# Altium schematic sheet Teensy3.2.SchDoc
size A
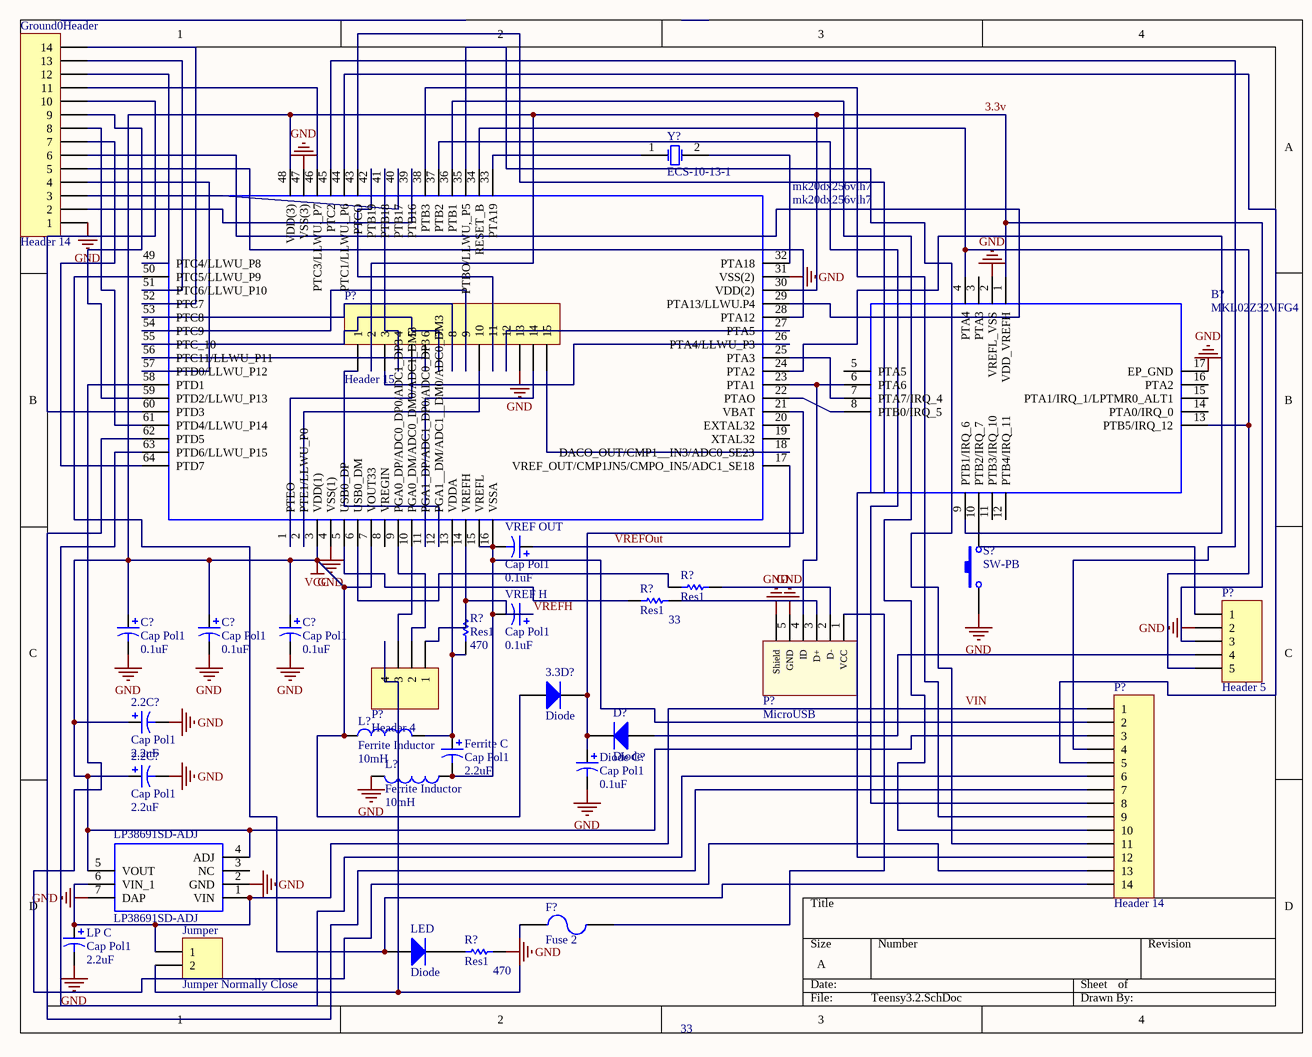
[diagram p0: Teensy3.2.SchDoc]

## Parts
(Parts that share a designator on the sheet are numbered #1, #2 ... from top to bottom, then left to right.)
2.2C?#1  Cap Pol1  value 2.2uF  [RAD-0.2]
2.2C?#2  Cap Pol1  value 2.2uF  [RAD-0.2]
3.3D?  Diode  [SMC]
B?  MKL02Z32VFG4  [QFN50P300X300X65-17N-D]
C?#1  Cap Pol1  value 0.1uF  [RAD-0.1]
C?#2  Cap Pol1  value 0.1uF  [RAD-0.1]
C?#3  Cap Pol1  value 0.1uF  [RAD-0.1]
D?  Diode  [SMC]
Diode_C?  Cap Pol1  value 0.1uF  [RAD-0.1]
F?  Fuse 2  [PIN-W2/E2.8]
Ferrite_C  Cap Pol1  value 2.2uF  [RAD-0.2]
Ground0Header  Header 14  [HDR1X14]
Jumper  Jumper Normally Close  [HDR1X2]
L?#1  Ferrite Inductor  value 10mH  [0402-A]
L?#2  Ferrite Inductor  value 10mH  [0402-A]
LED  Diode  [SMC]
LP38691SD-ADJ  LP38691SD-ADJ  [SON95P300X300X80-7N]
LP_C  Cap Pol1  value 2.2uF  [RAD-0.2]
mk20dx256vlh7  mk20dx256vlh7  [QFP50P1200X1200X160-64N]
P?#1  Header 15  [HDR1X15]
P?#2  Header 5  [HDR1X5]
P?#3  MicroUSB  [629105136821]
P?#4  Header 4  [HDR1X4]
P?#5  Header 14  [HDR1X14]
R?#1  Res1  value 33  [AXIAL-0.3]
R?#2  Res1  value 33  [AXIAL-0.3]
R?#3  Res1  value 470  [AXIAL-0.3]
R?#4  Res1  value 470  [AXIAL-0.3]
S?  SW-PB  [SPST-2]
VREF_H  Cap Pol1  value 0.1uF  [RAD-0.1]
VREF_OUT  Cap Pol1  value 0.1uF  [RAD-0.1]
Y?  ECS-10-13-1  [HC-49U]

## Nets
3.3v: 2.2C?#1.1 2.2C?#2.1 3.3D?.1(A) B?.1(VDD_VREFH) C?#1.1 C?#2.1 C?#3.1 L?#1.1 LP38691SD-ADJ.4(ADJ) LP38691SD-ADJ.5(VOUT) mk20dx256vlh7.3(VDD(1)) mk20dx256vlh7.7(VOUT33) mk20dx256vlh7.30(VDD(2)) mk20dx256vlh7.48(VDD(3)) P?#1.2 P?#2.3 P?#5.3  [also labelled VCC]
GND: 2.2C?#1.2 2.2C?#2.2 B?.2(VREFL_VSS) B?.17(EP_GND) C?#1.2 C?#2.2 C?#3.2 Diode_C?.2 Ground0Header.1 L?#2.2 LP38691SD-ADJ.2(GND) LP38691SD-ADJ.7(DAP) LP_C.2 mk20dx256vlh7.4(VSS(1)) mk20dx256vlh7.31(VSS(2)) mk20dx256vlh7.47(VSS(3)) P?#1.13 P?#2.2 P?#3.5(GND) P?#3.Shell(Shield) R?#4.1 S?.1
VIN: Jumper.1 LP38691SD-ADJ.1(VIN) LP38691SD-ADJ.6(VIN_1) LP_C.1 P?#5.1
VREFH: mk20dx256vlh7.14(VREFH) P?#4.1 R?#3.2 VREF_H.1
VREFOut: mk20dx256vlh7.17(VREF_OUT/CMP1JN5/CMPO_IN5/ADC1_SE18) VREF_OUT.1
Net3.3D?_2: 3.3D?.2(K) D?.2(K) Diode_C?.1 mk20dx256vlh7.21(VBAT)
NetB?_4: B?.4(PTA4) B?.13(PTB5/IRQ_12) mk20dx256vlh7.34(RESET_B) P?#2.5
NetB?_6: B?.6(PTA6) mk20dx256vlh7.23(PTA1) P?#3.4(ID)
NetB?_7: B?.7(PTA7/IRQ_4) mk20dx256vlh7.25(PTA3)
NetB?_8: B?.8(PTB0/IRQ_5) mk20dx256vlh7.22(PTAO)
NetB?_9: B?.9(PTB1/IRQ_6) mk20dx256vlh7.24(PTA2)
NetB?_10: B?.10(PTB2/IRQ_7) S?.2
NetD?_1: D?.1(A) P?#2.4
NetF?_1: F?.1 Jumper.2 P?#4.4
NetF?_2: F?.2 P?#3.1(VCC)
NetFerrite_C_1: Ferrite_C.1 L?#1.2 mk20dx256vlh7.13(VDDA) R?#3.1
NetFerrite_C_2: Ferrite_C.2 L?#2.1 mk20dx256vlh7.15(VREFL) mk20dx256vlh7.16(VSSA) P?#5.2 VREF_H.2 VREF_OUT.2
NetGround0Header_2: Ground0Header.2 mk20dx256vlh7.39(PTB16)
NetGround0Header_3: Ground0Header.3 mk20dx256vlh7.40(PTB17)
NetGround0Header_4: Ground0Header.4 mk20dx256vlh7.57(PTD0/LLWU_P12)
NetGround0Header_5: Ground0Header.5 mk20dx256vlh7.28(PTA12)
NetGround0Header_6: Ground0Header.6 mk20dx256vlh7.29(PTA13/LLWU.P4)
NetGround0Header_7: Ground0Header.7 mk20dx256vlh7.64(PTD7)
NetGround0Header_8: Ground0Header.8 mk20dx256vlh7.61(PTD4/LLWU_P14)
NetGround0Header_9: Ground0Header.9 mk20dx256vlh7.59(PTD2/LLWU_P13)
NetGround0Header_10: Ground0Header.10 mk20dx256vlh7.60(PTD3)
NetGround0Header_11: Ground0Header.11 mk20dx256vlh7.46(PTC3/LLWU._P7)
NetGround0Header_12: Ground0Header.12 mk20dx256vlh7.49(PTC4/LLWU_P8)
NetGround0Header_13: Ground0Header.13 mk20dx256vlh7.51(PTC6/LLWU_P10)
NetGround0Header_14: Ground0Header.14 mk20dx256vlh7.52(PTC7)
NetLED_1: LED.1(A) mk20dx256vlh7.50(PTC5/LLWU_P9) P?#5.14
NetLED_2: LED.2(K) R?#4.2
Netmk20dx256vlh7_1: mk20dx256vlh7.1(PTEO) P?#1.5
Netmk20dx256vlh7_2: mk20dx256vlh7.2(PTE1/LLWU_P0) P?#1.10
Netmk20dx256vlh7_5: mk20dx256vlh7.5(USB0_DP) R?#2.2
Netmk20dx256vlh7_6: mk20dx256vlh7.6(USB0_DM) R?#1.2
Netmk20dx256vlh7_9: mk20dx256vlh7.9(PGA0_DP/ADC0_DP0/ADC1_DP3) P?#4.2
Netmk20dx256vlh7_10: mk20dx256vlh7.10(PGA0_DM/ADC0_DM0/ADC1_DM3) P?#4.3
Netmk20dx256vlh7_11: mk20dx256vlh7.11(PGA1_DP/ADC1_DP0/ADC0_DP3) P?#1.14
Netmk20dx256vlh7_12: mk20dx256vlh7.12(PGA1__DM/ADC1__DM0/ADC0_DM3) P?#1.1
Netmk20dx256vlh7_18: mk20dx256vlh7.18(DACO_OUT/CMP1__IN3/ADC0_SE23) P?#1.15
Netmk20dx256vlh7_26: mk20dx256vlh7.26(PTA4/LLWU_P3) P?#1.3
Netmk20dx256vlh7_27: mk20dx256vlh7.27(PTA5) P?#1.12
Netmk20dx256vlh7_32: mk20dx256vlh7.32(PTA18) Y?.2(OSC2)
Netmk20dx256vlh7_33: mk20dx256vlh7.33(PTA19) Y?.1(OSC1)
Netmk20dx256vlh7_35: mk20dx256vlh7.35(PTBO/LLWU,_P5) P?#5.11
Netmk20dx256vlh7_36: mk20dx256vlh7.36(PTB1) P?#5.10
Netmk20dx256vlh7_37: mk20dx256vlh7.37(PTB2) P?#5.8
Netmk20dx256vlh7_38: mk20dx256vlh7.38(PTB3) P?#5.9
Netmk20dx256vlh7_41: mk20dx256vlh7.41(PTB18) P?#1.4
Netmk20dx256vlh7_42: mk20dx256vlh7.42(PTB19) P?#1.11
Netmk20dx256vlh7_43: mk20dx256vlh7.43(PTCO) P?#5.12
Netmk20dx256vlh7_44: mk20dx256vlh7.44(PTC1/LLWU._P6) P?#5.5
Netmk20dx256vlh7_45: mk20dx256vlh7.45(PTC2) P?#5.4
Netmk20dx256vlh7_53: mk20dx256vlh7.53(PTC8) P?#1.8
Netmk20dx256vlh7_54: mk20dx256vlh7.54(PTC9) P?#1.9
Netmk20dx256vlh7_55: mk20dx256vlh7.55(PTC_10) P?#1.7
Netmk20dx256vlh7_56: mk20dx256vlh7.56(PTC11/LLWU_P11) P?#1.6
Netmk20dx256vlh7_58: mk20dx256vlh7.58(PTD1) P?#5.13
Netmk20dx256vlh7_62: mk20dx256vlh7.62(PTD5) P?#5.7
Netmk20dx256vlh7_63: mk20dx256vlh7.63(PTD6/LLWU_P15) P?#5.6
NetP?#3_2: P?#3.2(D-) R?#1.1
NetP?#3_3: P?#3.3(D+) R?#2.1

Not connected (* = marked no-connect by the designer): B? 3(PTA3) 5(PTA5) 11(PTB3/IRQ_10) 12(PTB4/IRQ_11) 14(PTA0/IRQ_0) 15(PTA1/IRQ_1/LPTMR0_ALT1) 16(PTA2); LP38691SD-ADJ 3(NC); mk20dx256vlh7 8(VREGIN) 19(XTAL32) 20(EXTAL32); P?#2 1

## Library data of the parts
2.2C?#1 2.2C?#2 C?#1-C?#3 Diode_C? Ferrite_C LP_C VREF_H VREF_OUT = Cap Pol1: Polarized Capacitor (Radial); Published: 8-Jun-2000; LatestRevisionDate: 17-Jul-2002; LatestRevisionNote: Re-released for DXP Platform.; PackageReference: RB7.6-15; Publisher: Altium Limited; PackageDescription: Polarized Capacitor (Radial); 2 Leads
3.3D? D? LED = Diode: Default Diode; Published: 8-Jun-2000; LatestRevisionDate: 17-Jul-2002; LatestRevisionNote: Re-released for DXP Platform.; PackageVersion: Sep-1996; PackageReference: SMC; Publisher: Altium Limited; PackageDescription: DO-214-AB/SMC; 2 C-Bend Leads; Body 7.9 x 5.9 mm, inc. leads (LxW); Code_JEDEC: DO-214-AB
B? = MKL02Z32VFG4: Freescale MKL02Z32VFG4, 32bit ARM Cortex M0 Microcontroller, 48MHz, 32 kB Flash, 16-Pin QFN; Manufacturer_Name: Nexperia; Geometry.Height: 0.65mm; Supplier_Name: RS; RS Part Number: 7884723; Manufacturer_Part_Number: MKL02Z32VFG4; Allied_Number: *; Other Part Number: *; Datasheet Link: http://cache.nxp.com/files/32bit/doc/data_sheet/KL02P32M48SF0.pdf; 3D Package: *
F? = Fuse 2: Fuse; Published: 8-Jun-2000; LatestRevisionDate: 17-Jul-2002; LatestRevisionNote: Re-released for DXP Platform.; PackageReference: PIN-W2/E2.8; Publisher: Altium Limited; PackageDescription: Thru-Hole; 2 Leads
Ground0Header P?#5 = Header 14: Header, 14-Pin; LatestRevisionDate: 17-Jul-2002; LatestRevisionNote: Re-released for DXP Platform.; Publisher: Altium Limited
Jumper = Header 2: Header, 2-Pin; LatestRevisionDate: 17-Jul-2002; LatestRevisionNote: Re-released for DXP Platform.; Publisher: Altium Limited
L?#1 L?#2 = Inductor: Code_IEC: 1005; Published: 8-Jun-2000; LatestRevisionDate: 29-May-2009; LatestRevisionNote: IPC-7351 Footprint Added.; PackageReference: 0402-A; Publisher: Altium Limited; PackageDescription: Chip Inductor; Code_JEITA: 0402
LP38691SD-ADJ = LP38691SD-ADJ: 500mA LDO Regulator Adj.,LP38691SD-ADJ; Manufacturer_Name: Texas Instruments; Geometry.Height: 0.8mm; Supplier_Name: Mouser; Mouser Part Number: 926-LP38691SD-ADJ; Manufacturer_Part_Number: LP38691SD-ADJ; Datasheet Link: http://www.ti.com/lit/ds/symlink/lp38691-adj.pdf; 3D Package: *
mk20dx256vlh7 = mk20dx256vlh7: MK20DX256VLH7, ARM Cortex M4 MCU 72MHz 256 kB Flash, 64 kB RAM, USB CAN I2C 64-Pin LQFP; Manufacturer_Name: Nexperia; Geometry.Height: 1.6mm; Supplier_Name: RS; RS Part Number: 7862120P; Manufacturer_Part_Number: mk20dx256vlh7; Allied_Number: *; Other Part Number: *; Datasheet Link: https://www.pjrc.com/teensy/K20P64M72SF1.pdf; 3D Package: *
P?#1 = Header 15: Header, 15-Pin; LatestRevisionDate: 17-Jul-2002; LatestRevisionNote: Re-released for DXP Platform.; Publisher: Altium Limited
P?#2 = Header 5: Header, 5-Pin; LatestRevisionDate: 17-Jul-2002; LatestRevisionNote: Re-released for DXP Platform.; Publisher: Altium Limited
P?#3 = 629105136821: Micro USB 2.0 SMT Type B Horizontal 5 Contacts WR-COM; Interface Type: Type B; Gender: Receptacle; Publisher: Wurth Elektronik; ComponentLink1Description: Manufacturer; ComponentLink1URL: http://www.we-online.de; ComponentLink2Description: Datasheet; ComponentLink2URL: http://katalog.we-online.de/em/datasheet/629105136821.pdf; Part Number: 629105136821; Published Date: April 2017; Sub-Family: Micro USB 2.0; Type: Horizontal; Construction: SMT
P?#4 = Header 4: Header, 4-Pin; LatestRevisionDate: 17-Jul-2002; LatestRevisionNote: Re-released for DXP Platform.; Publisher: Altium Limited
R?#1-R?#4 = Res1: Resistor; Published: 8-Jun-2000; LatestRevisionDate: 17-Jul-2002; LatestRevisionNote: Re-released for DXP Platform.; PackageReference: AXIAL-0.3; Publisher: Altium Limited; PackageDescription: Axial Device, Thru-Hole; 2 Leads; 0.3 in Pin Spacing
S? = SW-PB: Switch; Published: 24-Mar-1999; LatestRevisionDate: 17-Jul-2002; LatestRevisionNote: Re-released for DXP Platform.; PackageReference: SPST-2; Publisher: Altium Limited; PackageDescription: Switch; 2 Leads
Y? = ECS-10-13-1: Crystal Oscillator; Published: 17-Jul-2002; DatasheetDocument: 18-Apr-2000; PackageReference: HC-49U; Publisher: Altium Limited; ComponentLink1Description: Manufacturer Link; ComponentLink1URL: http://www.ecsxtal.com/; ComponentLink2Description: Datasheet; ComponentLink2URL: http://www.ecsxtal.com/pdf2/HC49U.PDF